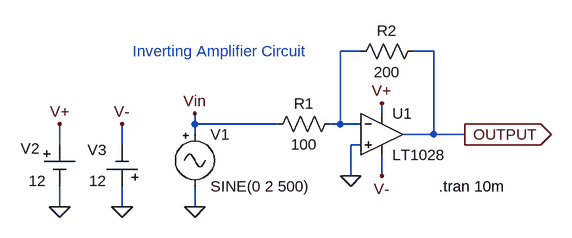
[diagram p0: schematic sample-circuit-lt1028.asc]
sample-circuit-lt1028.asc, the LTspice schematic file:
Version 4
SHEET 1 880 680
WIRE 144 16 112 16
WIRE 256 16 224 16
WIRE 176 112 176 96
WIRE -112 128 -112 112
WIRE 16 128 -112 128
WIRE 112 128 112 16
WIRE 112 128 96 128
WIRE 144 128 112 128
WIRE -112 144 -112 128
WIRE 256 144 256 16
WIRE 256 144 208 144
WIRE 304 144 256 144
WIRE -320 160 -320 128
WIRE -224 160 -224 128
WIRE 144 160 128 160
WIRE 128 208 128 160
WIRE 176 208 176 176
WIRE -320 256 -320 224
WIRE -224 256 -224 224
WIRE -112 256 -112 224
FLAG -112 256 0
FLAG 128 208 0
FLAG -320 256 0
FLAG -224 256 0
FLAG -320 128 V+
FLAG 176 96 V+
FLAG -224 128 V-
FLAG 176 208 V-
FLAG -112 112 Vin
FLAG 304 144 OUTPUT
IOPIN 304 144 Out
SYMBOL res 112 112 R90
WINDOW 0 0 56 VBottom 2
WINDOW 3 32 56 VTop 2
SYMATTR InstName R1
SYMATTR Value 100
SYMBOL res 240 0 R90
WINDOW 0 0 56 VBottom 2
WINDOW 3 32 56 VTop 2
SYMATTR InstName R2
SYMATTR Value 200
SYMBOL signal -112 128 R0
WINDOW 123 0 0 Left 0
WINDOW 39 0 0 Left 0
SYMATTR InstName V1
SYMATTR Value SINE(0 2 500)
SYMBOL cell -320 160 R0
WINDOW 0 -60 6 Left 2
WINDOW 3 -48 56 Left 2
WINDOW 123 0 0 Left 0
WINDOW 39 0 0 Left 0
SYMATTR InstName V2
SYMATTR Value 12
SYMBOL cell -224 224 R180
WINDOW 0 24 56 Left 2
WINDOW 3 24 8 Left 2
WINDOW 123 0 0 Left 0
WINDOW 39 0 0 Left 0
SYMATTR InstName V3
SYMATTR Value 12
SYMBOL LT1028 176 80 R0
SYMATTR InstName U1
TEXT -208 16 Left 2 ;Inverting Amplifier Circuit
TEXT 264 224 Left 2 !.tran 10m

The netlist it stands for:
* sample-circuit-lt1028.asc
R1 N001 Vin 100
R2 OUTPUT N001 200
V1 Vin 0 SINE(0 2 500)
V2 V+ 0 12
V3 0 V- 12
XU1 0 N001 V+ V- OUTPUT LT1028  ; pins In+ In- V+ V- OUT
* Inverting Amplifier Circuit
.tran 10m
.lib LTC.lib
.backanno
.end